# EAGLE design attiny13_driver (EAGLE 5.11)
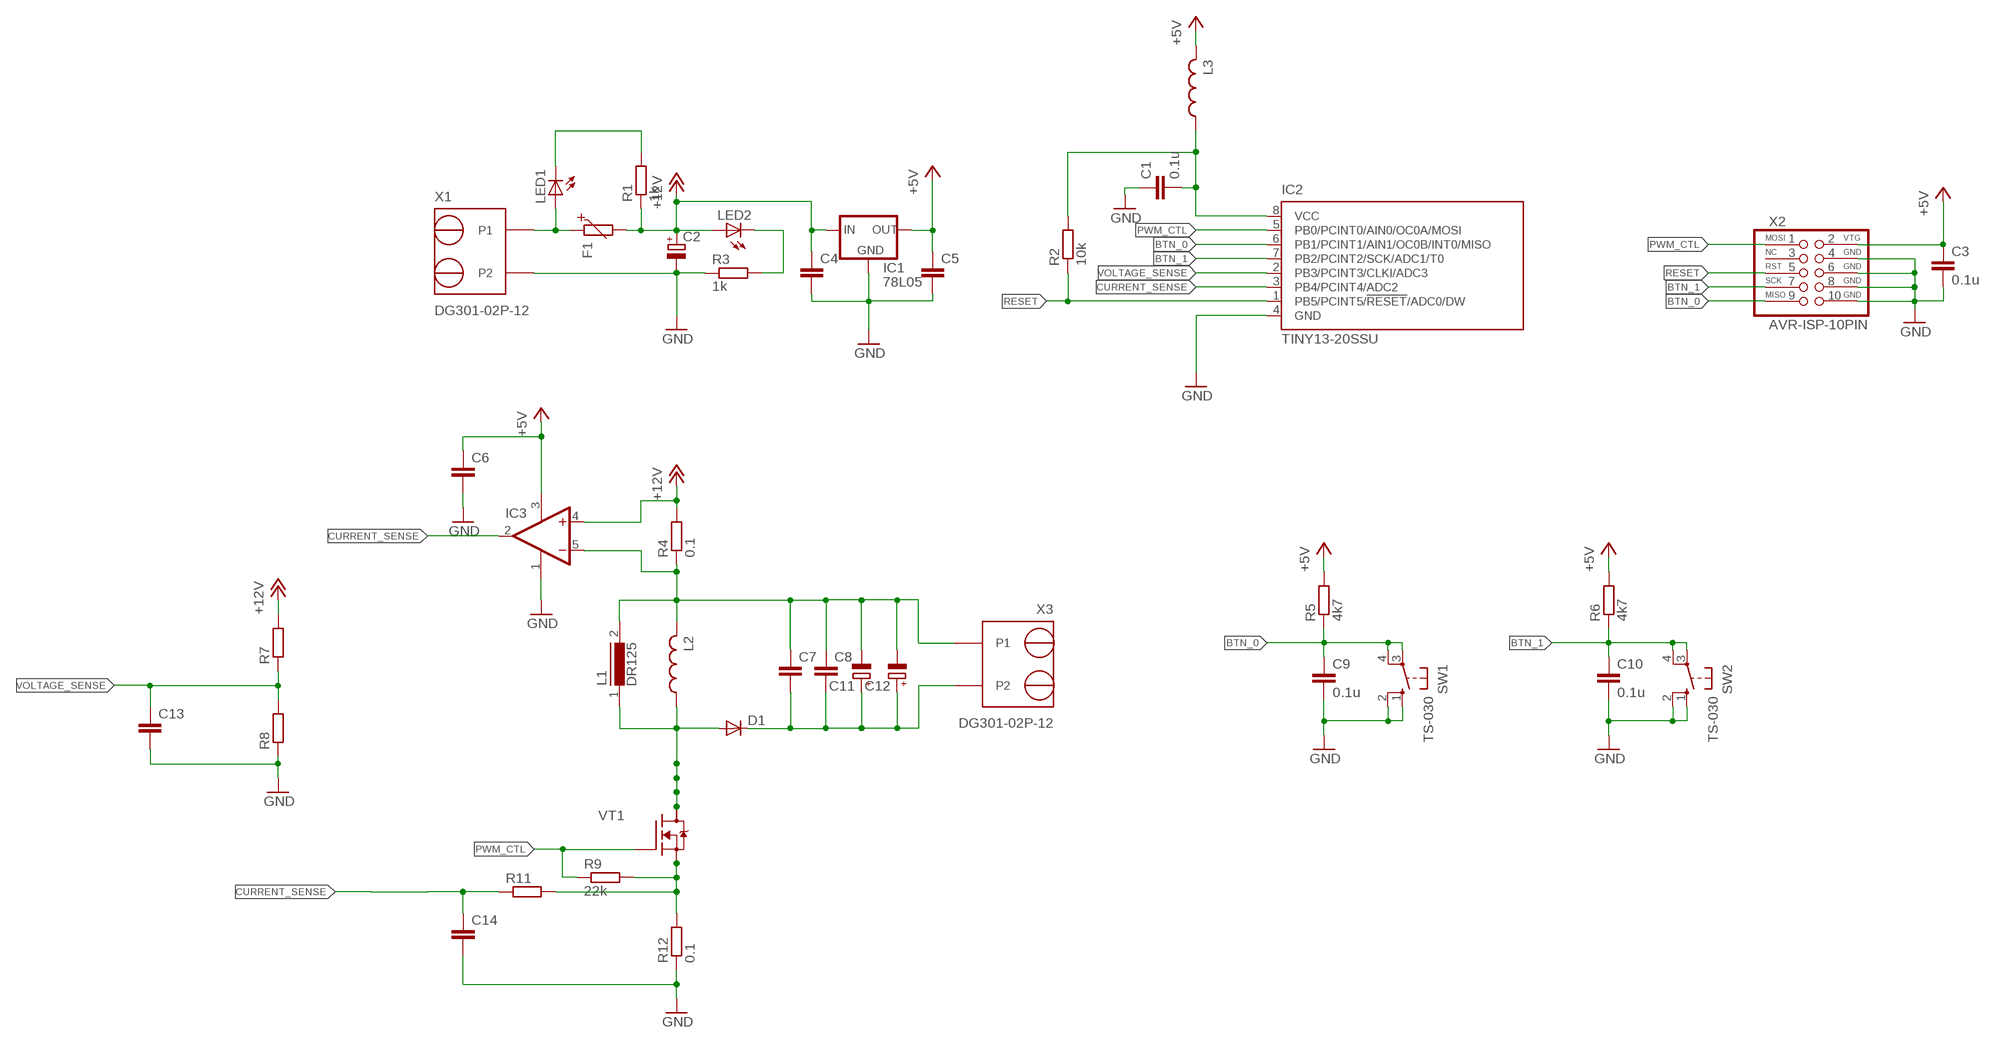
[diagram p0: schematic, sheet 1]

## Parts
C1  0.1u  C-EUC0603  [C0603]
C2  CPOL-EUD  [PANASONIC_D]
C3  0.1u  C-EUC0603  [C0603]
C4  C-EUC0603  [C0603]
C5  C-EUC0603  [C0603]
C6  C-EUC0603  [C0603]
C7  C-EUC1210  [C1210]
C8  C-EUC1210  [C1210]
C9  0.1u  C-EUC0603  [C0603]
C10  0.1u  C-EUC0603  [C0603]
C11  CPOL-EUSMCC  [SMC_C]
C12  CPOL-EUD  [PANASONIC_D]
C13  C-EUC0603  [C0603]
C14  C-EUC0603  [C0603]
D1  DIODE-SMC  [SMC]
F1  1812-RESETTABLE  [1812]
IC1  78L05  78LXX  [78LXX]
IC2  TINY13-20SSU  [8S1]
IC3  MAX4372  [SOT23-5]
L1  DR125  [DR125]
L2  INDUCTORDO5022P  [DO5022P]
L3  INDUCTOR0805  [L0805]
LED1  LEDCHIPLED_0805  [CHIPLED_0805]
LED2  LEDCHIPLED_0805  [CHIPLED_0805]
R1  1k  R-EU_R0603  [R0603]
R2  10k  R-EU_R0603  [R0603]
R3  1k  R-EU_R0603  [R0603]
R4  0.1  R-EU_R2512  [R2512]
R5  4k7  R-EU_R0603  [R0603]
R6  4k7  R-EU_R0603  [R0603]
R7  R-EU_R0603  [R0603]
R8  R-EU_R0603  [R0603]
R9  22k  R-EU_R0603  [R0603]
R11  R-EU_R0603  [R0603]
R12  0.1  R-EU_R2512  [R2512]
SW1  TS-030  [TS-030]
SW2  TS-030  [TS-030]
VT1  IRF78XX  [SO8-IR]
X1  DG301-02P-12  [DG301-02P-12]
X2  AVR-ISP-10PIN  [PIN2X5]
X3  DG301-02P-12  [DG301-02P-12]

## Nets
+5V: C3.1 C5.1 C6.1 IC1.OUT IC3.3(V+) L3.2 R5.2 R6.2 X2.2(VTG)
+12V: C2.+ C4.1 F1.2 IC1.IN IC3.4(+IN) LED2.A R1.1 R4.2 R7.2
BTN_0: C9.1 IC2.6(PB1/PCINT1/AIN1/OC0B/INT0/MISO) R5.1 SW1.3(P) SW1.4(P1) X2.9(MISO)
BTN_1: C10.1 IC2.7(PB2/PCINT2/SCK/ADC1/T0) R6.1 SW2.3(P) SW2.4(P1) X2.7(SCK)
CURRENT_SENSE: C14.1 IC2.3(PB4/PCINT4/ADC2) IC3.2(OUT) R11.1
CURRENT_SENSE_GND: R9.2 R11.2 R12.2 VT1.1(S) VT1.2(S) VT1.3(S)
GND: C1.1 C2.- C3.2 C4.2 C5.2 C6.2 C9.2 C10.2 C13.2 C14.2 IC1.GND IC2.4(GND) IC3.1(V-) R3.1 R8.1 R12.1 SW1.1(S) SW1.2(S1) SW2.1(S) SW2.2(S1) X1.P2 X2.4(GND1) X2.6(GND2) X2.8(GND3) X2.10(GND4)
N$1: LED2.C R3.2
N$2: D1.A L1.1 L2.1 VT1.5(D) VT1.6(D) VT1.7(D) VT1.8(D)
N$3: C7.2 C8.2 C11.+ C12.+ D1.C X3.P2
N$4: C1.2 IC2.8(VCC) L3.1 R2.2
N$8: C7.1 C8.1 C11.- C12.- IC3.5(-IN) L1.2 L2.2 R4.1 X3.P1
N$9: F1.1 LED1.A X1.P1
N$10: LED1.C R1.2
PWM_CTL: IC2.5(PB0/PCINT0/AIN0/OC0A/MOSI) R9.1 VT1.4(G) X2.1(MOSI)
RESET: IC2.1(PB5/PCINT5/!RESET!/ADC0/DW) R2.1 X2.5(RST)
VOLTAGE_SENSE: C13.1 IC2.2(PB3/PCINT3/CLKI/ADC3) R7.1 R8.2
Unconnected: X2.3(NC)

## Library data of the parts
C1 C3-C10 C13 C14 = rcl:C-EU: CAPACITOR, European symbol
C2 C11 C12 = rcl:CPOL-EU: POLARIZED CAPACITOR, European symbol
D1 = diode:DIODE-: DIODE
F1 = my-fuse:1812-RESETTABLE
IC1 = v-reg:78LXX: VOLTAGE REGULATOR
IC2 = atmel:TINY13: 8-bit AVR Microcontroller with 1K Bytes In-System Programmable Flash Source: http://www.atmel.com/dyn/resources/prod_documents/2535S.pdf
IC3 = my-ic:MAX4372
L1 = inductors:DR125: High Power Density, High Efficiency, Shielded Inductors Source: coiltronics_dr_series.pdf
L2 L3 = my-inductors:INDUCTOR
LED1 LED2 = led:LED: LED OSRAM: - CHIPLED LG R971, LG N971, LY N971, LG Q971, LY Q971, LO R971, LY R971 LH N974, LH R974 LS Q976, LO Q976, LY Q976 LO Q996 - Hyper CHIPLED LW Q18S LB Q993, LB Q99A, LB R99A - SideLED LS A670, LO A670, LY A670, LG A670, LP A670 LB A673, LV A673, LT A673, LW A673 LH A674 LY A675 LS A676, LA A676, LO A676, LY A676, LW A676 LS A679, LY A679, LG A679 - Hyper Micro SIDELED® LS Y876, LA Y876, LO Y876, LY Y876 LT Y87S - SmartLED LW L88C, LW L88S LB L89C, LB L89S, LG L890 LS L89K, LO L89K, LY L89K LS L896, LA L896, LO L896, LY L896 - TOPLED LS T670, LO T670, LY T670, LG T670, LP T670 LSG T670, LSP T670, LSY T670, LOP T670, LYG T670 LG T671, LOG T671, LSG T671 LB T673, LV T673, LT T673, LW T673 LH T674 LS T676, LA T676, LO T676, LY T676, LB T676, LH T676, LSB T676, LW T676 LB T67C, LV T67C, LT T67C, LS T67K, LO T67K, LY T67K, LW E67C LS E67B, LA E67B, LO E67B, LY E67B, LB E67C, LV E67C, LT E67C LW T67C LS T679, LY T679, LG T679 LS T770, LO T770, LY T770, LG T770, LP T770 LB T773, LV T773, LT T773, LW T773 LH T774 LS E675, LA E675, LY E675, LS T675 LS T776, LA T776, LO T776, LY T776, LB T776 LHGB T686 LT T68C, LB T68C - Hyper Mini TOPLED® LB M676 - Mini TOPLED Santana® LG M470 LS M47K, LO M47K, LY M47K Source: http://www.osram.convergy.de LUXEON: - LUMILED® LXK2-PW12-R00, LXK2-PW12-S00, LXK2-PW14-U00, LXK2-PW14-V00 LXK2-PM12-R00, LXK2-PM12-S00, LXK2-PM14-U00 LXK2-PE12-Q00, LXK2-PE12-R00, LXK2-PE12-S00, LXK2-PE14-T00, LXK2-PE14-U00 LXK2-PB12-K00, LXK2-PB12-L00, LXK2-PB12-M00, LXK2-PB14-N00, LXK2-PB14-P00, LXK2-PB14-Q00 LXK2-PR12-L00, LXK2-PR12-M00, LXK2-PR14-Q00, LXK2-PR14-R00 LXK2-PD12-Q00, LXK2-PD12-R00, LXK2-PD12-S00 LXK2-PH12-R00, LXK2-PH12-S00 LXK2-PL12-P00, LXK2-PL12-Q00, LXK2-PL12-R00 Source: www.luxeon.com KINGBRIGHT: KA-3528ASYC Source: www.kingbright.com
R1-R3 R5-R9 R11 = rcl:R-EU_: RESISTOR, European symbol
R4 R12 = resistor:R-EU_: RESISTOR, European symbol
SW1 SW2 = switch-omron:TS-030
VT1 = my-transistors:IRF78XX
X1 X3 = my-connectors:DG301-02P-12
X2 = my-connectors:AVR-ISP-10PIN

## Board
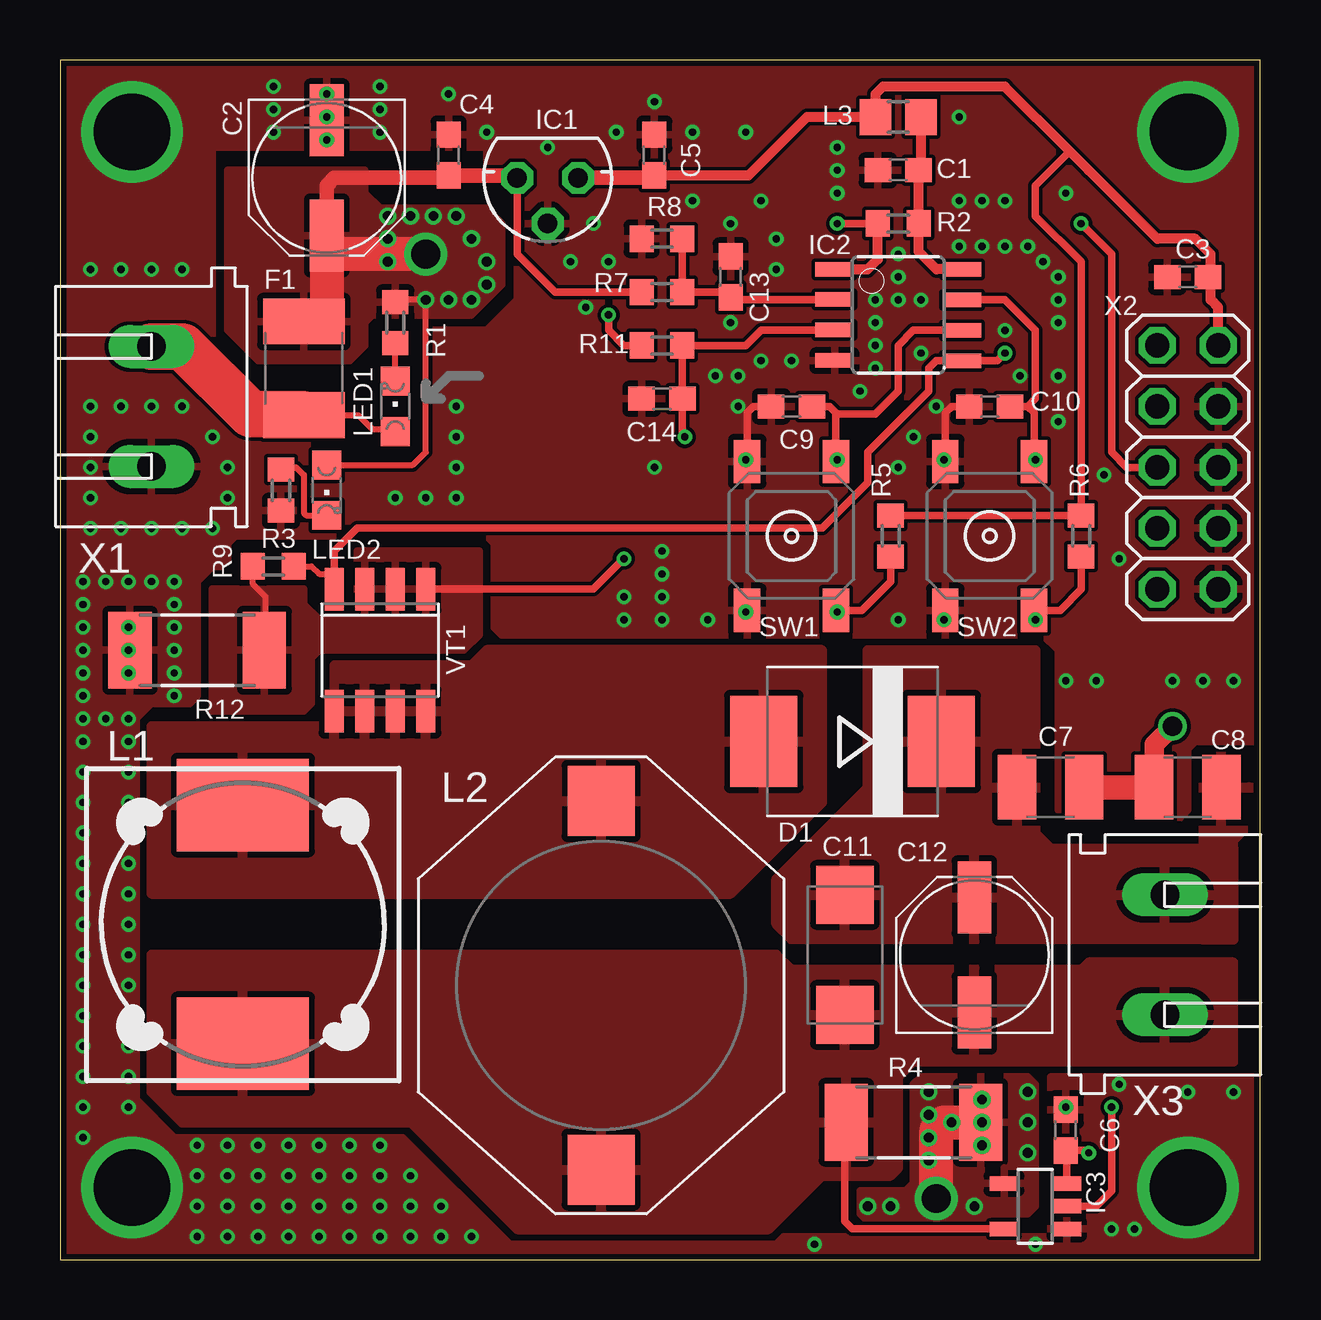
[diagram p1: board, top side]
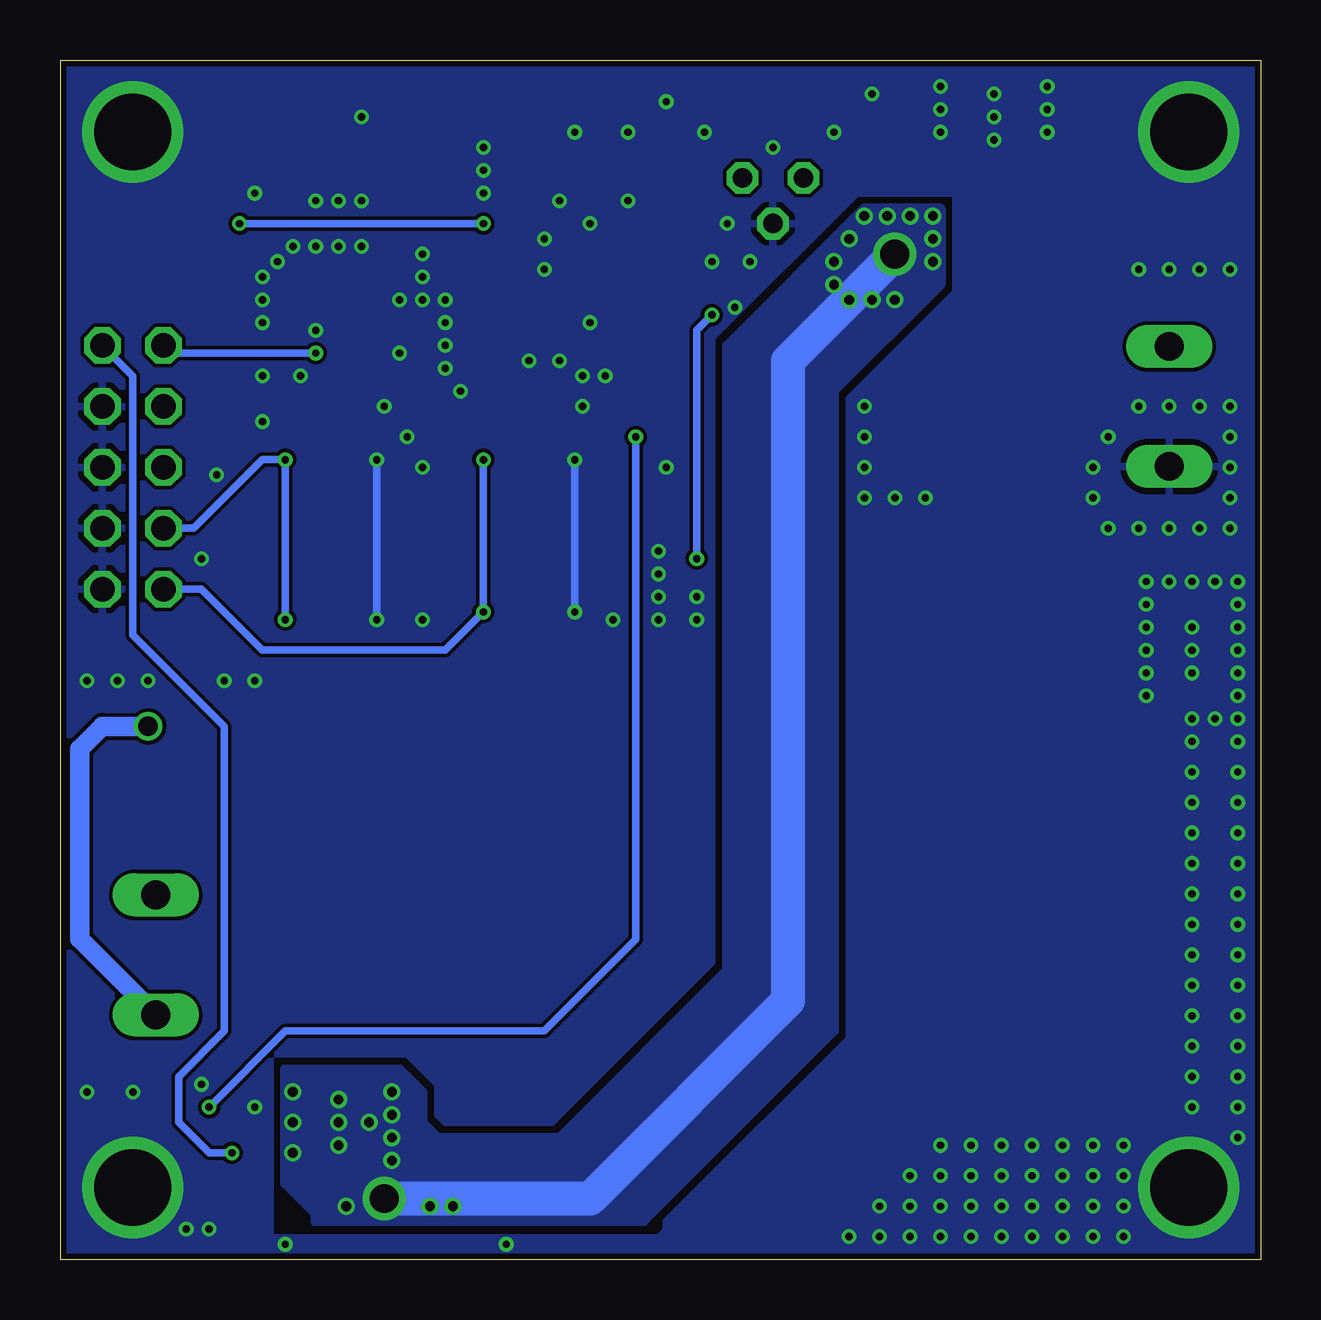
[diagram p2: board, bottom side, seen from below]

Size 50 x 50 mm. Coordinates in mm from the lower left corner, seen from the top.
Outline: 0,0 50,0 50,50 0,50 0,0
Copper layers (1*16): Top 0.035mm / dielectric 1.5mm / Bottom 0.035mm
Design rules "Fusion_eagle_rule_v1.1": minimum track width 6mil, minimum drill 12mil, track to track 6mil, track to pad 6mil, pad to pad 6mil, via to via 6mil, smd to smd 0mil, copper to edge 10mil, drill to drill 10mil, minimum pad ring 10mil, minimum via ring 6mil, stop-mask expansion 2mil, vias tented up to drill 100mil, thermal gap 10mil

### Footprints (pad centres in the part's own frame; a part is rotated, then mirrored left to right if it is on the bottom)
C0603 = smd 1.1 x 1: 1 -0.85,0; 2 0.85,0
PANASONIC_D = smd 3 x 1.4: + 2.4,0; - -2.4,0
C1210 = smd 1.6 x 2.7: 1 -1.4,0; 2 1.4,0
SMC_C = smd 2.4 x 2.4: + -2.5,0; - 2.5,0
SMC = smd 2.8 x 3.8: A 3.7,0; C -3.7,0
1812 = smd 1.9 x 3.4: 1 -1.95,0; 2 1.95,0
78LXX = drill 0.813 octagon: GND 0,1.905; IN 1.27,0; OUT -1.27,0
8S1 = smd 0.6 x 1.6: 1 -1.905,-2.654; 2 -0.645,-2.654; 3 0.625,-2.654; 4 1.895,-2.654; 5 1.905,2.654; 6 0.635,2.654; 7 -0.635,2.654; 8 -1.905,2.654
SOT23-5 = smd 0.6 x 1.2: 1 -0.95,-1.306; 2 0,-1.306; 3 0.95,-1.306; 4 0.95,1.306; 5 -0.95,1.306
DR125 = smd 3.85 x 5.5: 1 -4.975,0; 2 4.975,0
DO5022P = smd 2.92 x 2.79: 1 -7.685,0; 2 7.685,0
L0805 = smd 1.3 x 1.5: 1 -0.95,0; 2 0.95,0
CHIPLED_0805 = smd 1.2 x 1.2: A 0,-1.05; C 0,1.05
R0603 = smd 1 x 1.1: 1 -0.85,0; 2 0.85,0
R2512 = smd 1.8 x 3.2: 1 -2.8,0; 2 2.8,0
TS-030 = smd 1.8 x 1.1: 1 -3.1,1.85; 2 3.1,1.85; 3 -3.1,-1.85; 4 3.1,-1.85
SO8-IR = smd 0.8 x 1.78: 1 -1.905,-2.543; 2 -0.635,-2.543; 3 0.635,-2.543; 4 1.905,-2.543; 5 1.905,2.543; 6 0.635,2.543; 7 -0.635,2.543; 8 -1.905,2.543
DG301-02P-12 = drill 1.2 long: P1 -2.5,0; P2 2.5,0
PIN2X5 = drill 1.016 octagon: 1 -1.27,5.08; 2 1.27,5.08; 3 -1.27,2.54; 4 1.27,2.54; 5 -1.27,0; 6 1.27,0; 7 -1.27,-2.54; 8 1.27,-2.54; 9 -1.27,-5.08; 10 1.27,-5.08

### Placement (x,y rotation side)
C1  34.92,45.4 0 top
C2  11.11,45.09 270 top
C3  46.99,40.96 180 top
C4  16.19,46.04 90 top
C5  24.77,46.04 90 top
C6  41.91,5.4 90 top
C7  41.27,19.68 180 top
C8  46.99,19.68 0 top
C9  30.48,35.56 180 top
C10  38.73,35.56 180 top
C11  32.7,12.7 270 top
C12  38.1,12.7 90 top
C13  27.94,40.96 90 top
C14  25.08,35.88 180 top
D1  33.02,21.59 180 top
F1  10.16,37.15 90 top
IC1  20.32,45.09 180 top
IC2  34.92,39.37 270 top
IC3  40.64,2.22 90 top
L1  7.62,13.97 270 top
L2  22.54,11.43 270 top
L3  34.92,47.62 180 top
LED1  13.97,35.56 0 top
LED2  11.11,32.07 180 top
R1  13.97,39.05 270 top
R2  34.92,43.18 0 top
R3  9.21,32.07 90 top
R4  35.56,5.71 0 top
R5  34.61,30.16 90 top
R6  42.55,30.16 90 top
R7  25.08,40.32 180 top
R8  25.08,42.55 0 top
R9  8.89,28.89 180 top
R11  25.08,38.1 180 top
R12  5.71,25.4 0 top
SW1  30.48,30.16 90 top
SW2  38.73,30.16 90 top
U$1  [SWAN]  3.49,7.94 0 top
U$2  [SWAN_SUPERSMALL]  17.78,7.94 0 top
VT1  13.34,25.4 180 top
X1  3.81,35.56 270 top
X2  46.99,33.02 0 top
X3  46.04,12.7 90 top

### Tracks (layer width: path | path; a pad name or v marks a point on that pad's centre or on a via)
+5V  (via drill 0.3)
  Top 0.305: IC3.3 41.95,4.19 C6.1 42.65,4.55 v42.86,4.45 | R5.2 R6.2 42.55,41.59 40.64,43.5 40.64,44.77 42.07,46.2
  Top 0.406: C5.1 28.68,45.19 31.11,47.62 L3.2 33.97,48.58 34.29,48.9 39.37,48.9 42.07,46.2 42.86,45.4 43.81,44.45 45.72,42.55 47.31,42.55 47.94,41.91 47.94,41.06 C3.1 47.94,40.85 47.94,40.01 48.26,39.69 X2.2
  Top 0.61: IC1.OUT 24.66,45.09 C5.1
  Bottom 0.305: v42.86,4.45 43.81,4.45 45.09,5.71 45.09,7.62 43.18,9.53 43.18,22.23 46.99,26.04 46.99,36.83 X2.2
+12V  (via drill 0.41, 1.2)
  Top 0.254: 11.11,39.69 11.33,39.9 | LED2.A 14.7,33.12 15.24,33.66 15.24,39.69 14.92,40.01 14.07,40.01 R1.1
  Top 0.305: R4.2 38.42,5.66 | R7.2 20.64,40.32 19.05,41.91 IC1.IN
  Top 0.61: IC1.IN 18.95,45.19 C4.1 16.09,45.09 11.43,45.09 11.11,44.77 C2.+
  Top 1.422: 11.11,41.91 11.11,39.69 11.11,39.05 10.21,39.05 F1.2 | 11.11,41.91 C2.+ | R4.2 36.83,5.71 36.51,5.4 v36.51,2.54 | v15.24,41.91 11.11,41.91
  Bottom 1.422: v36.51,2.54 27.94,2.54 19.68,10.79 19.68,37.47 v15.24,41.91
  other vias: 15.24,40.01 16.19,40.01 17.78,40.64 17.78,41.59 13.65,42.55 16.51,43.5 17.14,42.55 13.65,43.5 13.65,41.59 17.14,40.01 14.61,43.5 15.56,43.5 33.66,2.22 34.61,2.22 36.2,4.13 36.2,5.08 36.2,6.03 36.2,6.99 38.42,6.67 38.42,5.71 38.42,4.76 37.15,5.71 40.32,6.99 40.32,5.71 40.32,4.45 38.1,2.22
  pour Bottom: 13.34,43.81 13.34,40.64 17.78,36.2 17.78,9.53 25.72,1.59 39.37,1.59 39.37,1.91 40.64,3.17 40.64,7.94 35.88,7.94 34.92,6.99 34.92,5.71 34.29,5.08 29.21,5.08 22.23,12.06 22.23,38.1 16.51,43.81
  pour Top: 6.99,45.09 6.99,38.73 8.26,37.47 12.06,37.47 12.7,38.1 12.7,39.05 13.02,39.37 17.14,39.37 18.41,40.64 18.41,43.18 17.78,43.81 13.34,43.81 12.7,44.45 12.7,45.4 6.99,45.4
  pour Top: 33.34,2.86 33.34,1.91 33.66,1.59 38.42,1.59 38.73,1.91 40.32,1.91 40.64,2.22 40.64,7.3 40.32,7.62 35.88,7.62 35.56,7.3 35.56,3.17 35.24,2.86
BTN_0  (via drill 0.3)
  Top 0.305: 32.33,35.3 SW1.4 32.26,33.34 v32.38,33.34 | 32.33,35.3 32.07,35.56 C9.1 | IC2.6 35.56,38.73 34.92,38.1 34.92,36.2 33.97,35.24 32.38,35.24 32.33,35.3 | R5.1 34.61,28.26 33.41,27.06 SW1.3 32.33,26.93 v32.38,26.99
  Bottom 0.305: v32.38,33.34 32.46,33.26 SW1.4 32.38,33.21 v32.38,26.99 33.97,25.4 41.59,25.4 44.13,27.94 X2.9
BTN_1  (via drill 0.3)
  Top 0.305: R6.1 42.55,27.94 41.67,27.06 SW2.3 40.59,27.25 v40.64,26.67 | 40.32,35.56 40.59,35.3 SW2.4 40.64,33.21 v40.64,33.34 | 40.32,35.56 C10.1 39.69,35.66 | IC2.7 39.05,40.01 39.37,40.01 40.64,38.73 40.64,35.88 40.32,35.56
  Bottom 0.305: v40.64,26.67 v40.64,33.34 41.59,33.34 44.45,30.48 X2.7
CURRENT_SENSE  (via drill 0.3)
  Top 0.305: IC2.3 29.21,38.73 28.57,38.1 R11.1 C14.1 25.93,34.39 v26.04,34.29 | v43.81,6.35 43.81,2.86 43.18,2.22 IC3.2
  Bottom 0.305: v26.04,34.29 26.04,13.34 29.84,9.53 40.64,9.53 v43.81,6.35
CURRENT_SENSE_GND  (via drill 0.3)
  Top 0.254: R9.2 8.04,28.16 8.57,27.62 8.57,25.46 R12.2
  Top 0.305: VT1.1 22.23,27.94 v23.5,29.21 | v22.86,39.37 22.86,38.73 23.5,38.1 R11.2
  Bottom 0.305: v23.5,29.21 23.5,38.73 v22.86,39.37
  pour Top: 6.35,27.94 6.35,22.86 10.16,22.86 10.48,23.18 10.48,25.08 10.79,25.4 16.83,25.4 17.46,26.04 17.46,29.53 12.38,29.53 12.38,26.67 10.79,26.67 10.16,27.3 10.16,27.94
GND  (via drill 0.3, 3.2)
  Top 0.305: 28.63,33.39 SW1.2 28.63,33.39 | 28.63,33.39 28.63,35.3 28.89,35.56 C9.2 | C10.2 37.15,35.56 36.88,35.3 SW2.2 36.83,33.52 v36.83,33.34 | v28.57,33.34 28.63,33.39 | v28.57,26.99 28.57,27.12 SW1.1 | SW2.1 36.88,26.93 v36.83,26.67
  Bottom 0.305: v28.57,26.99 v28.57,33.34 | v36.83,26.67 v36.83,33.34
  other vias: 3,3 3,47 47,47 47,3 1.27,30.48 2.54,30.48 3.81,30.48 5.08,30.48 6.35,30.48 6.99,31.75 6.99,33.02 6.35,34.29 5.08,35.56 3.81,35.56 2.54,35.56 1.27,35.56 1.27,34.29 1.27,33.02 1.27,31.75 1.27,41.27 2.54,41.27 3.81,41.27 5.08,41.27 8.89,46.99 8.89,47.94 8.89,48.9 13.34,48.9 13.34,47.94 13.34,46.99 11.11,48.58 11.11,47.62 11.11,46.67 22.23,43.18 21.27,41.59 22.86,41.59 24.77,48.26 23.18,46.99 26.35,46.99 17.78,46.99 16.19,48.58 20.32,46.35 32.38,45.4 32.38,46.35 32.38,44.45 26.35,44.13 29.21,44.13 28.57,46.99 39.37,42.23 39.37,44.13 41.91,44.45 43.5,32.7 33.97,40.01 34.92,40.01 35.88,40.01 33.97,39.05 33.97,38.1 33.97,37.15 33.34,36.2 30.48,37.47 29.21,37.47 28.26,36.83 27.94,39.05 27.3,36.83 28.26,35.56 24.77,33.02 21.91,39.69 25.08,29.53 23.5,26.67 25.08,26.67 26.99,26.67 2.86,26.35 2.86,25.4 2.86,24.45 0.95,25.4 0.95,26.35 0.95,27.3 0.95,28.26 1.91,28.26 2.86,28.26 3.81,28.26 4.76,28.26 4.76,27.3 4.76,26.35 4.76,25.4 4.76,24.45 4.76,23.5 0.95,24.45 0.95,23.5 0.95,22.54 1.91,22.54 2.86,22.54 13.34,3.49 13.34,2.22 13.34,0.95 14.61,3.49 14.61,2.22 14.61,0.95 15.88,0.95 15.88,2.22 17.14,0.95 12.06,3.49 12.06,2.22 12.06,0.95 31.43,0.64 43.81,1.27 40.64,0.64 44.13,7.3 41.91,6.35 48.9,6.99 46.99,6.99 48.9,24.13 47.62,24.13 46.35,24.13 43.18,24.13 41.91,24.13 44.13,29.21 34.92,26.67 34.92,33.02 35.56,34.29 39.37,38.73 40.01,36.83 41.59,36.83 41.59,34.92 36.51,35.56 35.88,37.78 29.84,41.27 29.84,42.55 27.94,43.18 38.42,44.13 37.47,44.13 38.42,42.23 37.47,42.23 37.47,47.62 16.51,35.56 16.51,34.29 16.51,33.02 16.51,31.75 13.97,31.75 15.24,31.75 44.77,1.27 0.95,21.59 0.95,20.32 0.95,19.05 0.95,17.78 0.95,16.51 0.95,15.24 0.95,13.97 0.95,12.7 0.95,11.43 0.95,10.16 0.95,8.89 0.95,7.62 0.95,6.35 0.95,5.08 5.71,0.95 6.99,0.95 8.26,0.95 9.53,0.95 10.79,0.95 13.34,4.76 12.06,4.76 40.32,42.23 40.96,41.59 41.59,40.96 41.59,40.01 41.59,39.05 34.92,40.96 34.92,41.91 23.5,27.62 25.08,27.62 25.08,28.57 10.79,4.76 10.79,3.49 10.79,2.22 9.53,2.22 9.53,3.49 9.53,4.76 8.26,4.76 8.26,3.49 8.26,2.22 6.99,2.22 6.99,3.49 6.99,4.76 5.71,4.76 5.71,3.49 5.71,2.22 2.86,21.59 2.86,20.32 2.86,19.05 2.86,17.78 2.86,16.51 2.86,15.24 2.86,13.97 2.86,12.7 2.86,11.43 2.86,10.16 2.86,8.89 2.86,7.62 2.86,6.35
  pour Top: 0,50.16 0,0 50.16,0 50.16,7.62 41.27,7.62 41.27,0.95 30.16,0.95 29.84,0.64 18.73,0.64 14.29,5.08 4.76,5.08 3.17,6.67 3.17,22.54 3.81,23.18 5.4,23.18 5.71,23.5 5.71,28.26 6.35,28.89 6.67,28.89 6.99,29.21 6.99,29.84 7.3,30.16 17.78,30.16 18.1,29.84 18.1,26.35 18.41,26.04 40.96,26.04 41.59,25.4 41.59,18.73 42.55,17.78 46.35,17.78 46.35,18.1 46.99,18.73 46.99,21.27 47.31,21.59 50.16,21.59 50.16,49.85 17.78,49.85 17.78,44.77 19.05,43.5 19.05,40.01 17.78,38.73 13.97,38.73 13.34,38.1 13.34,37.78 12.38,36.83 7.94,36.83 6.35,38.42 6.35,50.16
  pour Top: 0,49.85 0,46.35 18.41,46.35 18.41,50.16 0,50.16
  pour Bottom: 0,50.16 0,0 24.13,0 24.77,0.64 24.77,1.59 24.13,2.22 17.14,9.21 17.14,35.88 12.7,40.32 12.7,44.45 16.83,44.45 22.86,38.42 22.86,12.38 29.53,5.71 33.97,5.71 34.29,6.03 34.29,7.3 35.56,8.57 41.27,8.57 41.27,0 50.16,0 50.16,50.16
  pour Bottom: 24.13,1.27 24.13,0 49.53,0 49.53,0.95 49.21,6.03 48.9,6.35 46.67,6.35 45.09,4.76 45.09,0.95 25.08,0.95 24.77,1.27
N$1
  Top 0.254: LED2.C 10.26,31.02 10.16,31.11 10.16,32.7 9.84,33.02 9.31,33.02 R3.2
N$2
  pour Top: 3.81,22.23 3.81,15.24 27.94,15.24 31.75,19.05 31.75,25.4 17.78,25.4 17.14,24.77 11.43,24.77 11.43,22.23
N$3
  pour Top: 48.9,13.34 30.48,13.34 29.84,13.97 29.84,15.88 33.66,19.68 33.66,25.4 40.64,25.4 40.64,17.78 41.27,17.14 48.9,17.14
  pour Top: 47.62,20.95 47.62,13.34 48.9,13.34 48.9,17.46 49.53,18.1 49.53,20.95
N$4
  Top 0.406: IC2.8 36.51,41.27 35.77,42.01 R2.2 C1.2 35.88,45.5 L3.1
N$8  (via drill 0.8)
  Top 0.305: R4.1 32.7,5.66 32.7,2.54 32.7,1.59 33.02,1.27 IC3.5
  Top 0.813: C8.1 45.59,21.46 v46.35,22.23
  Top 1.016: C8.1 C7.1
  Bottom 0.813: v46.35,22.23 48.26,22.23 49.21,21.27 49.21,13.38 X3.P1
  pour Top: 3.81,12.7 3.81,6.99 5.08,5.71 14.61,5.71 19.05,1.27 29.53,1.27 31.75,3.49 34.61,3.49 34.92,3.81 34.92,7.62 35.56,8.26 48.9,8.26 48.9,12.38 42.86,12.38 42.55,12.06 30.48,12.06 29.84,12.7
N$9
  Top 0.254: F1.1 12.43,35.2 13.02,34.61 13.87,34.61 LED1.A
  Top 1.93: X1.P1 5.12,38.06 7.94,35.24 10.12,35.24 F1.1
N$10
  Top 0.254: LED1.C R1.2
PWM_CTL  (via drill 0.3)
  Top 0.254: R9.1 10.48,28.89 10.79,28.57 11.43,28.57 VT1.4
  Top 0.305: 11.43,28.57 11.43,29.53 12.38,30.48 31.75,30.48 33.66,32.38 33.66,33.66 36.2,36.2 36.2,37.15 36.51,37.47 IC2.5 39.05,37.47 v39.37,37.78
  Bottom 0.305: v39.37,37.78 45.4,37.78 X2.1
RESET  (via drill 0.3)
  Top 0.305: X2.5 44.45,33.02 43.81,33.66 43.81,41.91 v42.55,43.18 | R2.1 v32.38,43.18
  Top 0.406: R2.1 34.08,41.7 33.66,41.27 IC2.1
  Bottom 0.305: v32.38,43.18 v42.55,43.18
VOLTAGE_SENSE
  Top 0.305: IC2.2 28.03,40.02 C13.1 27.73,40.32 R7.1 R8.2

### Text on the board
tDocu: +12V | + | + | OVER | +12 | CURRENT | - | + | - | + | + | LED | AVR-ISP | DRIVER | - | - | - | v.0.1 | + | + | + | - | - | -